# Altium schematic sheet Shield.SchDoc
size A4; SheetNumber: 1; SheetTotal: 1
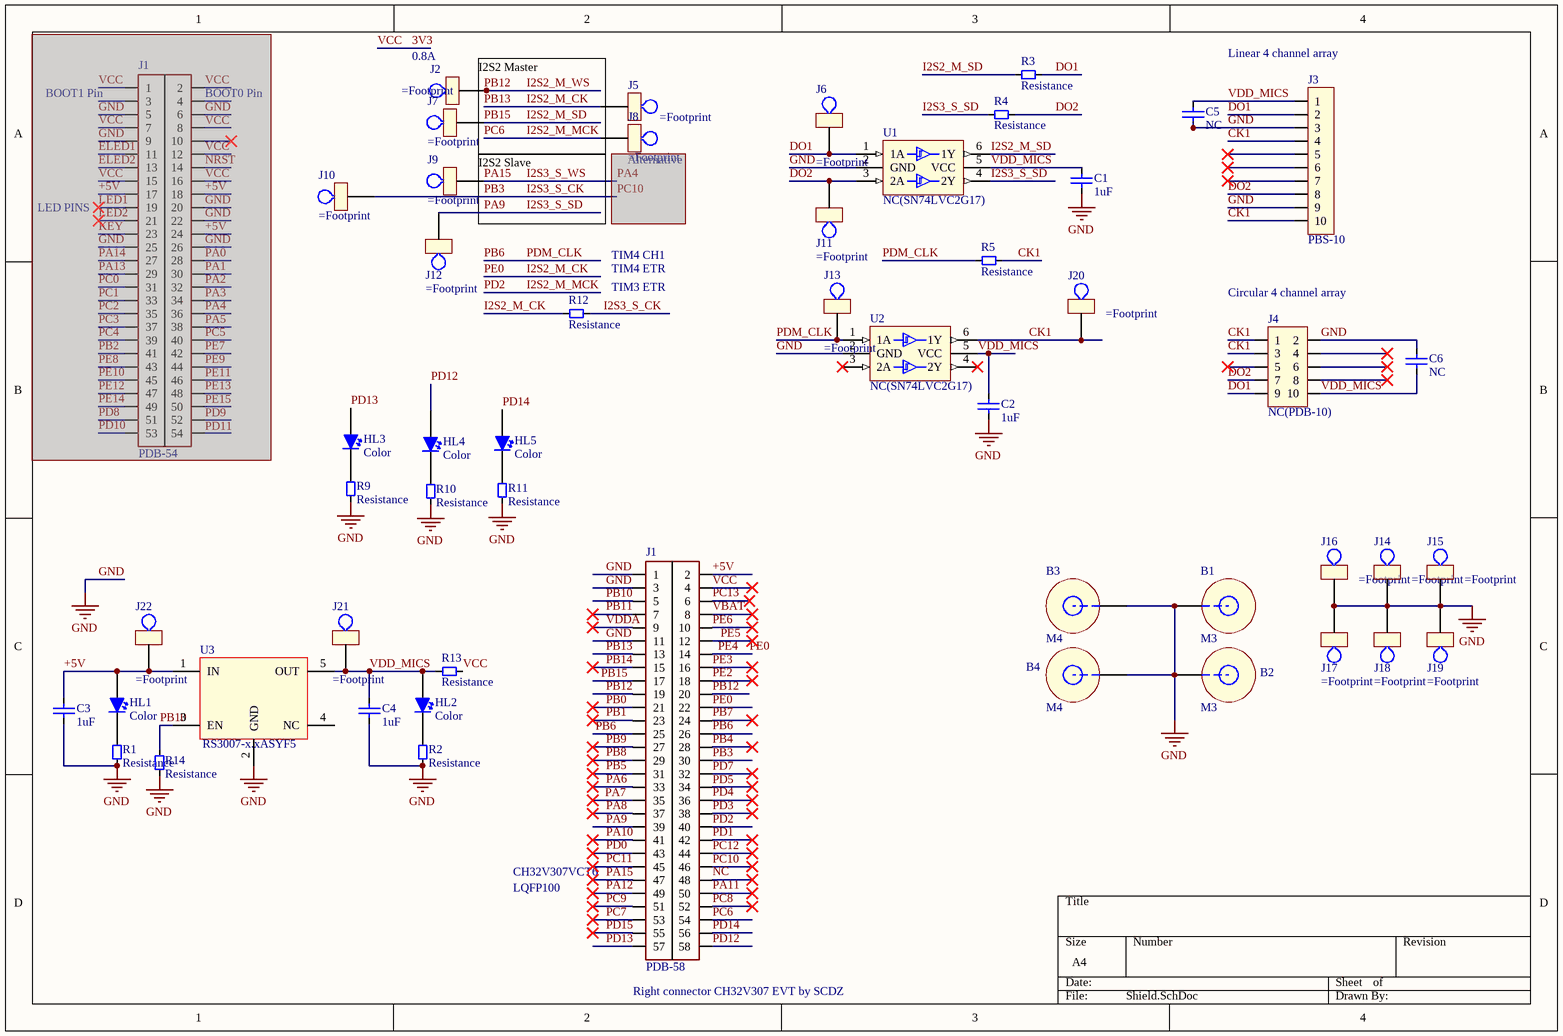
[diagram p0: Shield.SchDoc]

## Parts
(Parts that share a designator on the sheet are numbered #1, #2 ... from top to bottom, then left to right.)
B1  M3  [M3_Plated_Hole_NO_3D]  (no BOM)
B2  M3  [M3_Plated_Hole_NO_3D]  (no BOM)
B3  M4  [M4]
B4  M4  [M4]
C1  1uF  [CAP_0603]
C2  1uF  [CAP_0603]
C3  1uF  [CAP_0603]
C4  1uF  [CAP_0603]
C5  NC  [CAP_0603]
C6  NC  [CAP_0603]
HL1  Color  [LED_0603]
HL2  Color  [LED_0603]
HL3  Color  [LED_0603]
HL4  Color  [LED_0603]
HL5  Color  [LED_0603]
J1#1  PDB-54  (masked out: inside a compile mask, not in the netlist)
J1#2  PDB-58  [PBD-58]
J2  (no value)  [5001]
J3  PBS-10  [PBS-10]
J4  NC(PDB-10)  [PDB-10]
J5  (no value)  [5001]
J6  (no value)  [5001]
J7  (no value)  [5001]
J8  (no value)  [5001]
J9  (no value)  [5001]
J10  (no value)  [5001]
J11  (no value)  [5001]
J12  (no value)  [5001]
J13  (no value)  [5001]
J14  (no value)  [5001]
J15  (no value)  [5001]
J16  (no value)  [5001]
J17  (no value)  [5001]
J18  (no value)  [5001]
J19  (no value)  [5001]
J20  (no value)  [5001]
J21  (no value)  [5001]
J22  (no value)  [5001]
R1  Resistance  [RES_0603]
R2  Resistance  [RES_0603]
R3  Resistance  [RES_0603]
R4  Resistance  [RES_0603]
R5  Resistance  [RES_0603]
R9  Resistance  [RES_0603]
R10  Resistance  [RES_0603]
R11  Resistance  [RES_0603]
R12  Resistance  [RES_0603]
R13  Resistance  [RES_0603]
R14  Resistance  [RES_0603]
U1  NC(SN74LVC2G17)  [SOT23-6]
U2  NC(SN74LVC2G17)  [SOT23-6]
U3  RS3007-x.xASYF5  [SOT23-5]

## Nets
GND: B1.1 B2.1 B3.1 B4.1 C1.1 C2.1 C3.1 C4.1 C5.1 C6.2 J1#2.1 J1#2.3 J1#2.11 J3.3 J3.9 J4.2 J14.1 J15.1 J16.1 J17.1 J18.1 J19.1 R1.1 R2.1 R9.1 R10.1 R11.1 R14.1 U1.2(GND) U2.2(GND) U3.2(GND)
3V3: J1#2.4 R13.1  [also labelled VCC]
+5V: C3.2 HL1.1 J1#2.2 J22.1 U3.1(IN)
CK1: J3.4 J3.10 J4.1 J4.3 J20.1 R5.2 U2.6(1Y)
DO1: J3.2 J4.9 J6.1 R3.2 U1.1(1A)
DO2: J3.8 J4.7 J11.1 R4.2 U1.3(2A)
I2S2_M_CK: J1#2.13 J1#2.14 J1#2.22 J5.1 R12.1  [also labelled PB13, PE0, PE4]
I2S2_M_MCK: J1#2.40 J1#2.54 J8.1  [also labelled PC6, PD2]
I2S2_M_SD: J1#2.17 J7.1 R3.1 U1.6(1Y)  [also labelled PB15]
I2S2_M_WS: J1#2.19 J1#2.20 J2.1  [also labelled PB12]
I2S3_S_CK: J1#2.30 J10.1 R12.2  [also labelled PB3]
I2S3_S_SD: J1#2.39 J12.1 R4.1 U1.4(2Y)  [also labelled PA9]
I2S3_S_WS: J1#2.47 J9.1  [also labelled PA15]
NC: J1#2.48
PA6: J1#2.33
PA7: J1#2.35
PA8: J1#2.37
PA10: J1#2.41
PA11: J1#2.50
PA12: J1#2.49
PB0: J1#2.21
PB1: J1#2.23
PB4: J1#2.28
PB5: J1#2.31
PB6: J1#2.25 J1#2.26 J13.1 R5.1 U2.1(1A)  [also labelled PDM_CLK]
PB7: J1#2.24
PB8: J1#2.29
PB9: J1#2.27
PB10: J1#2.5 R14.2 U3.3(EN)
PB11: J1#2.7
PB14: J1#2.15
PC7: J1#2.53
PC8: J1#2.52
PC9: J1#2.51
PC10: J1#2.46
PC11: J1#2.45
PC12: J1#2.44
PC13: J1#2.6
PD0: J1#2.43
PD1: J1#2.42
PD3: J1#2.38
PD4: J1#2.36
PD5: J1#2.34
PD7: J1#2.32
PD12: HL4.1 J1#2.58
PD13: HL3.1 J1#2.57
PD14: HL5.1 J1#2.56
PD15: J1#2.55
PE2: J1#2.18
PE3: J1#2.16
PE5: J1#2.12
PE6: J1#2.10
VBAT: J1#2.8
VDD_MICS: C1.2 C2.2 C4.2 C5.2 C6.1 HL2.1 J3.1 J4.10 J21.1 R13.2 U1.5(VCC) U2.5(VCC) U3.5(OUT)
VDDA: J1#2.9
NetHL1_2: HL1.2 R1.2
NetHL2_2: HL2.2 R2.2
NetHL3_2: HL3.2 R9.2
NetHL4_2: HL4.2 R10.2
NetHL5_2: HL5.2 R11.2

Not connected (* = marked no-connect by the designer): J3 5* 6* 7*; J4 4* 5* 6* 8*; U2 3(2A)* 4(2Y)*; U3 4(NC)

## Notes on the sheet
- (near J1#1) BOOT1 Pin
- (near J1#1) BOOT0 Pin
- (near J2) 0.8A
- Linear 4 channel array
- I2S2 Master
- (near J8) Alternative
- (near J1#1) LED PINS
- I2S2 Slave
- (near R12) TIM4 ETR
- (near R12) TIM3 ETR
- TIM4 CH1
- (near J4) Circular 4 channel array
- CH32V307VCT6
- LQFP100
- (near J1#2) Right connector CH32V307 EVT by SCDZ

## Library data of the parts
B1 B2 = M3: Machine Screw, M3
C1-C6 = Capacitor_Non-polar
HL1-HL5 = SMD_LED
J2 J5-J22 = Test_Point
J4 = PDB-10
R1-R5 R9-R14 = Resistor
U1 U2 = SN74LVC2G17: Dual Schmitt-Trigger Buffer
U3 = RS3007-x.x(A)SYF5: LDO, Vin < 45V, 300mA  xx _Is_Voltage (A)-is1%